# EAGLE design NixieDriver_mx (EAGLE 7.1.0)
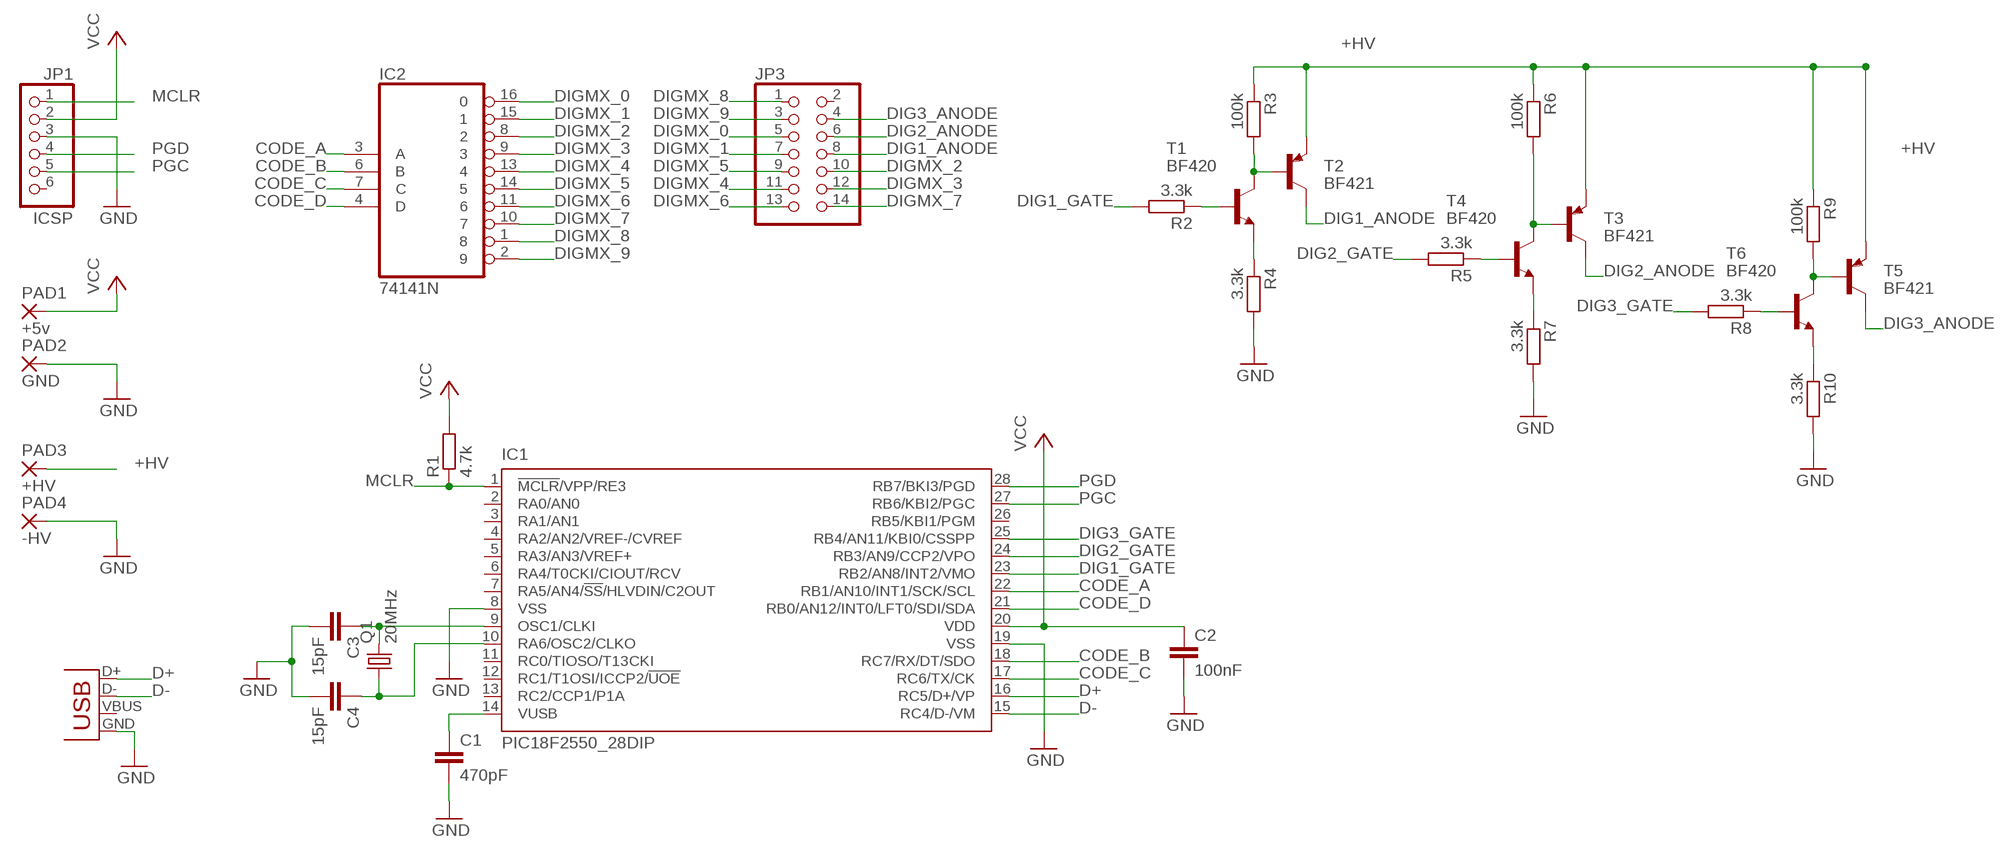
[diagram p0: schematic, sheet 1]

## Parts
C1  470pF  C-EU050-024X044  [C050-024X044]
C2  100nF  C-EU050-024X044  [C050-024X044]
C3  15pF  C-EU050-024X044  [C050-024X044]
C4  15pF  C-EU050-024X044  [C050-024X044]
IC1  PIC18F2550_28DIP  [DIL28-3]
IC2  74141N  [DIL16]
JP1  ICSP  PINHD-1X6  [1X06]
JP3  PINHD-2X7  [2X07]
PAD1  +5v  SMD5  [SMD2,54-5,08]
PAD2  GND  SMD5  [SMD2,54-5,08]
PAD3  +HV  SMD5  [SMD2,54-5,08]
PAD4  -HV  SMD5  [SMD2,54-5,08]
Q1  20MHz  CRYSTALHC49S  [HC49/S]
R1  4.7k  R-EU_0207/2V  [0207/2V]
R2  3.3k  R-EU_0207/2V  [0207/2V]
R3  100k  R-EU_0207/5V  [0207/5V]
R4  3.3k  R-EU_0207/7  [0207/7]
R5  3.3k  R-EU_0207/2V  [0207/2V]
R6  100k  R-EU_0207/5V  [0207/5V]
R7  3.3k  R-EU_0207/7  [0207/7]
R8  3.3k  R-EU_0207/2V  [0207/2V]
R9  100k  R-EU_0207/5V  [0207/5V]
R10  3.3k  R-EU_0207/7  [0207/7]
T1  BF420  BC368-NPN-TO92-ECB  [TO92-ECB]
T2  BF421  -PNP-TO92-ECB  [TO92-ECB]
T3  BF421  -PNP-TO92-ECB  [TO92-ECB]
T4  BF420  BC368-NPN-TO92-ECB  [TO92-ECB]
T5  BF421  -PNP-TO92-ECB  [TO92-ECB]
T6  BF420  BC368-NPN-TO92-ECB  [TO92-ECB]
X1  USB-B-H  [USB-B-H]

## Nets
+HV: PAD3.1(P) R3.1 R6.1 R9.1 T2.E T3.E T5.E
CODE_A: IC1.22(RB1/AN10/INT1/SCK/SCL) IC2.3(A)
CODE_B: IC1.18(RC7/RX/DT/SDO) IC2.6(B)
CODE_C: IC1.17(RC6/TX/CK) IC2.7(C)
CODE_D: IC1.21(RB0/AN12/INT0/LFT0/SDI/SDA) IC2.4(D)
D+: IC1.16(RC5/D+/VP) X1.D+
D-: IC1.15(RC4/D-/VM) X1.D-
DIG1_ANODE: JP3.8 T2.C
DIG1_GATE: IC1.23(RB2/AN8/INT2/VMO) R2.2
DIG2_ANODE: JP3.6 T3.C
DIG2_GATE: IC1.24(RB3/AN9/CCP2/VPO) R5.2
DIG3_ANODE: JP3.4 T5.C
DIG3_GATE: IC1.25(RB4/AN11/KBI0/CSSPP) R8.2
DIGMX_0: IC2.16 JP3.5
DIGMX_1: IC2.15 JP3.7
DIGMX_2: IC2.8 JP3.10
DIGMX_3: IC2.9 JP3.12
DIGMX_4: IC2.13 JP3.11
DIGMX_5: IC2.14 JP3.9
DIGMX_6: IC2.11 JP3.13
DIGMX_7: IC2.10 JP3.14
DIGMX_8: IC2.1 JP3.1
DIGMX_9: IC2.2 JP3.3
GND: C1.2 C2.2 C3.2 C4.2 IC1.8(VSS) IC1.19(VSS) JP1.3 PAD2.1(P) PAD4.1(P) R4.2 R7.2 R10.2 X1.GND
MCLR: IC1.1(!MCLR!/VPP/RE3) JP1.1 R1.1
N$1: C1.1 IC1.14(VUSB)
N$2: C3.1 IC1.9(OSC1/CLKI) Q1.2
N$3: C4.1 IC1.10(RA6/OSC2/CLKO) Q1.1
N$4: R3.2 T1.C T2.B
N$5: R2.1 T1.B
N$6: R4.1 T1.E
N$7: R6.2 T3.B T4.C
N$8: R7.1 T4.E
N$9: R5.1 T4.B
N$10: R9.2 T5.B T6.C
N$11: R10.1 T6.E
N$12: R8.1 T6.B
PGC: IC1.27(RB6/KBI2/PGC) JP1.5
PGD: IC1.28(RB7/BKI3/PGD) JP1.4
VCC: C2.1 IC1.20(VDD) JP1.2 PAD1.1(P) R1.2
Unconnected: IC1.2(RA0/AN0) IC1.3(RA1/AN1) IC1.4(RA2/AN2/VREF-/CVREF) IC1.5(RA3/AN3/VREF+) IC1.6(RA4/T0CKI/CIOUT/RCV) IC1.7(RA5/AN4/!SS!/HLVDIN/C2OUT) IC1.11(RC0/TIOSO/T13CKI) IC1.12(RC1/T1OSI/ICCP2/!UOE) IC1.13(RC2/CCP1/P1A) IC1.26(RB5/KBI1/PGM) JP1.6 JP3.2 X1.VBUS

## Power pins joined to a net without a drawn wire
GND: IC2.12(GND)
VCC: IC2.5(VCC)

## Library data of the parts
C1-C4 = rcl:C-EU: CAPACITOR, European symbol
IC1 = microchip:PIC18F2*_28: USB Microcontrollers with nanoWatt Technology High-Performance, Enhanced Flash, 28/40/44-Pin, Source: http://ww1.microchip.com/downloads/en/devicedoc/39632c.pdf; MF: MICROCHIP; MPN: PIC18F2550-I/SP; OC_FARNELL: 1523822; OC_NEWARK: 80K6054
IC2 = 74xx-eu:74*141: BCD to decimal DECODER/DRIVER
JP1 = pinhead:PINHD-1X6: PIN HEADER
JP3 = pinhead:PINHD-2X7: PIN HEADER
PAD1-PAD4 = wirepad:SMD5: SMD PAD
Q1 = crystal:CRYSTAL: CRYSTAL; OC_FARNELL: 1667008; OC_NEWARK: unknown
R1-R10 = rcl:R-EU_: RESISTOR, European symbol
T1 T4 T6 = transistor-neu-to92:*-NPN-: NPN Transistror
T2 T3 T5 = transistor-neu-to92:*-PNP-: PNP Transistror
X1 = con-usb:USB: USB Connectors

## Board
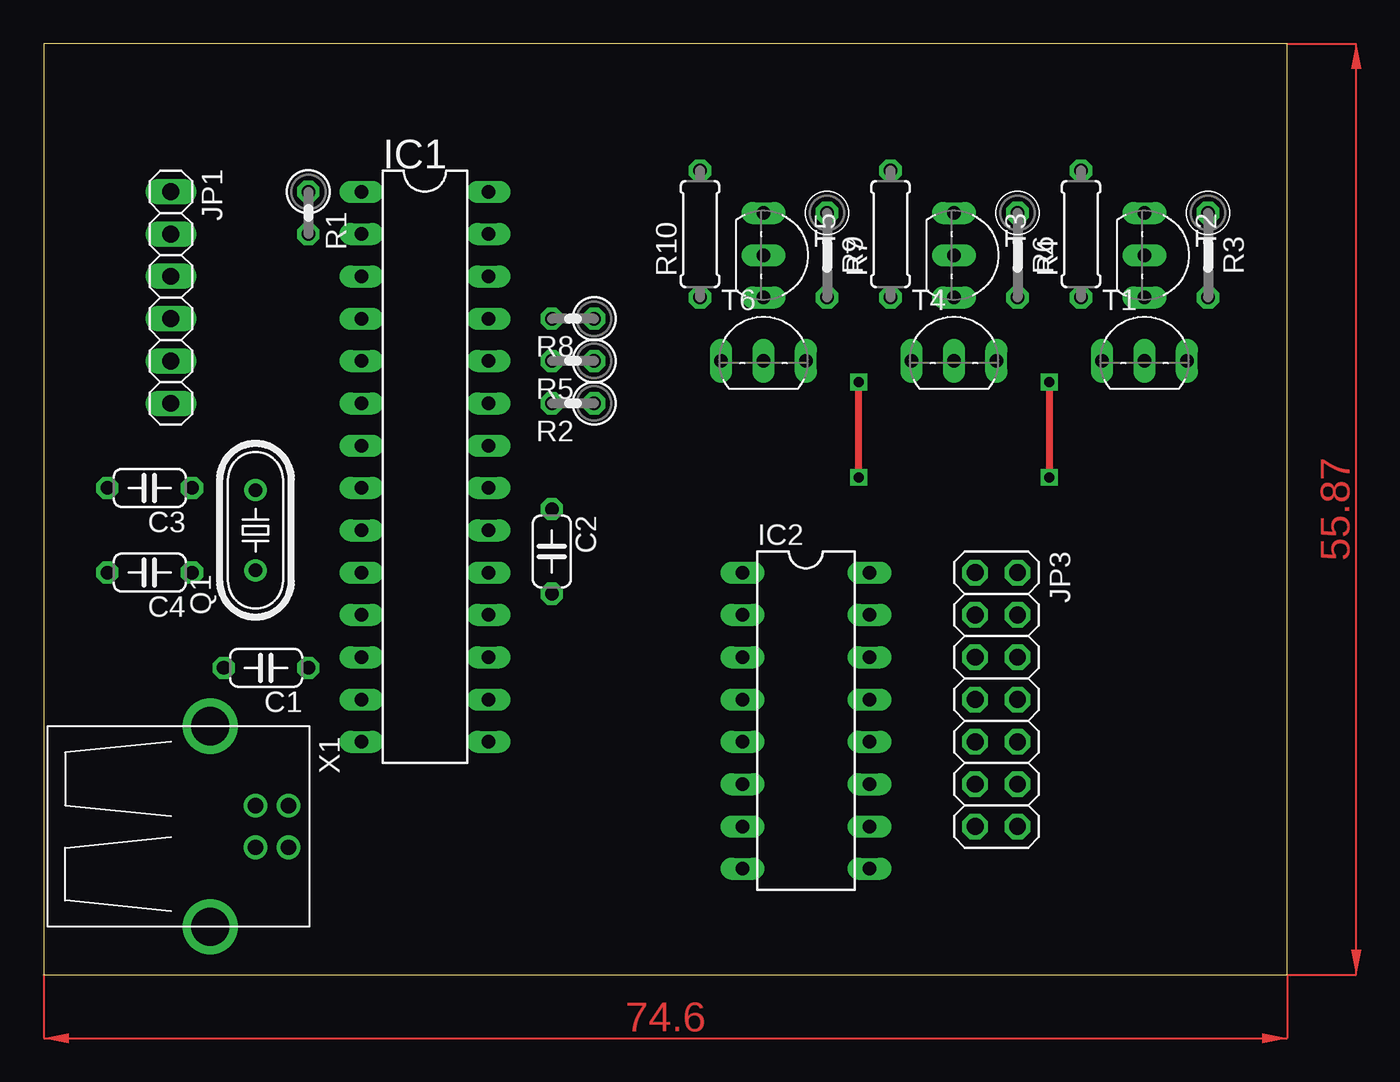
[diagram p1: board, top side]
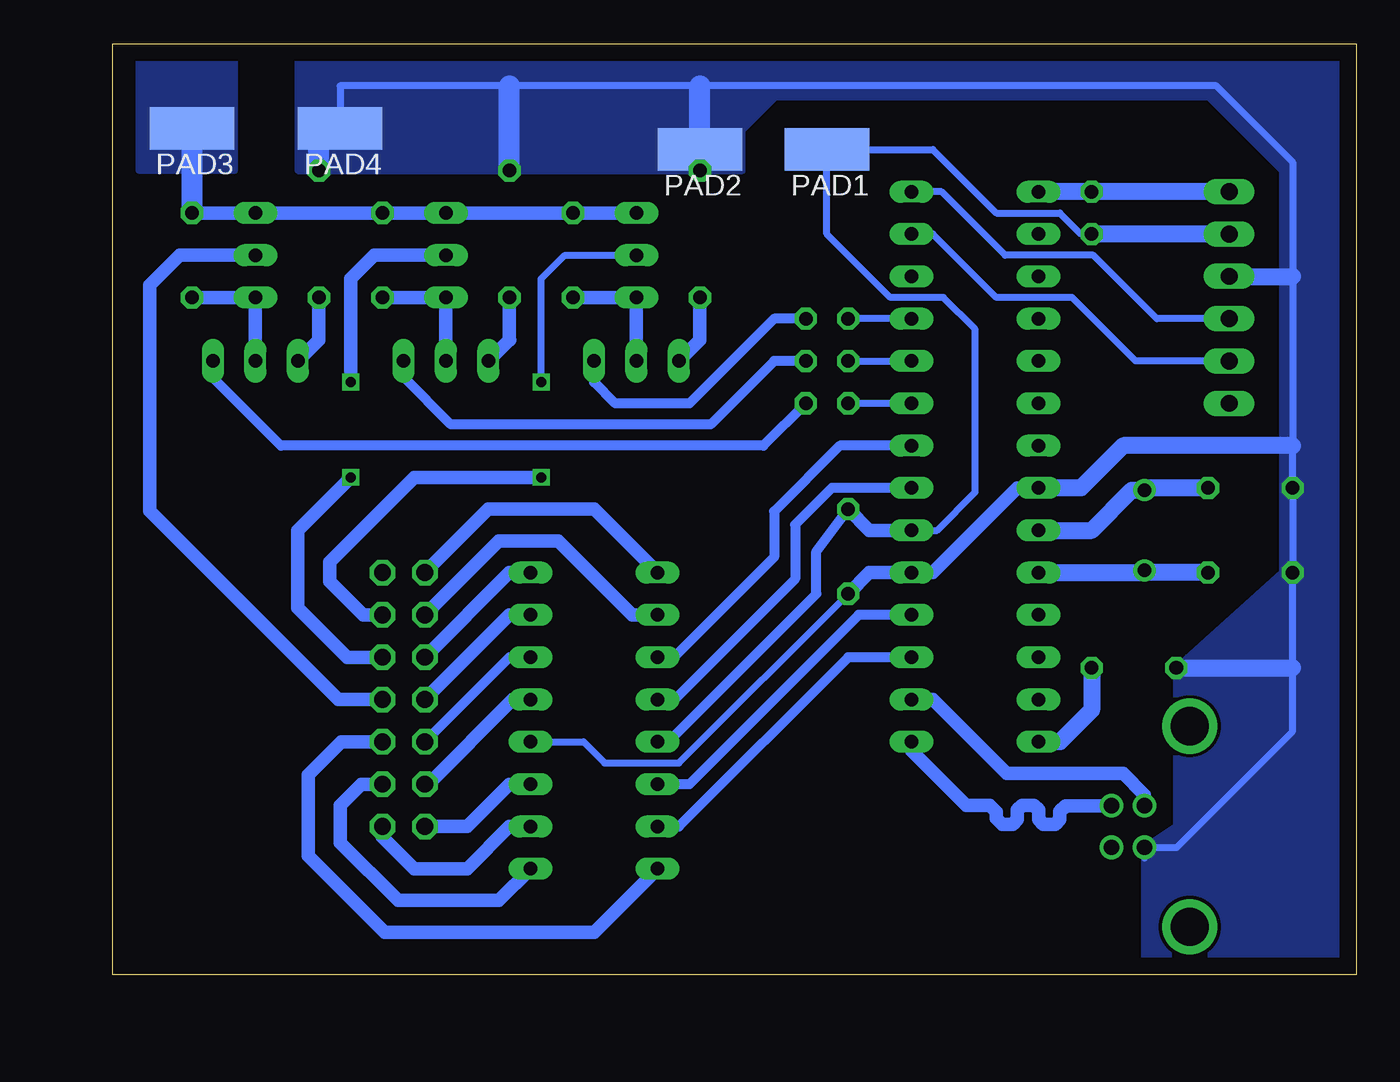
[diagram p2: board, bottom side, seen from below]

Size 74.6 x 55.87 mm. Coordinates in mm from the lower left corner, seen from the top.
Outline: 0,0 74.6,0 74.6,55.87 0,55.87 0,0
Copper layers (1*16): Top 0.035mm / dielectric 1.5mm / Bottom 0.035mm
Design rules "default": minimum track width 10mil, minimum drill 24mil, track to track 8mil, track to pad 8mil, pad to pad 8mil, via to via 8mil, smd to smd 8mil, copper to edge 40mil, drill to drill 8mil, minimum pad ring 10mil, minimum via ring 8mil, stop-mask expansion 4mil, vias tented up to drill 0mil, thermal gap 10mil

### Footprints (pad centres in the part's own frame; a part is rotated, then mirrored left to right if it is on the bottom)
C050-024X044 = drill 0.813 octagon: 1 -2.54,0; 2 2.54,0
DIL28-3 = drill 0.813 long: 1 -16.51,-3.81; 2 -13.97,-3.81; 3 -11.43,-3.81; 4 -8.89,-3.81; 5 -6.35,-3.81; 6 -3.81,-3.81; 7 -1.27,-3.81; 8 1.27,-3.81; 9 3.81,-3.81; 10 6.35,-3.81; 11 8.89,-3.81; 12 11.43,-3.81; 13 13.97,-3.81; 14 16.51,-3.81; 15 16.51,3.81; 16 13.97,3.81; 17 11.43,3.81; 18 8.89,3.81; 19 6.35,3.81; 20 3.81,3.81; 21 1.27,3.81; 22 -1.27,3.81; 23 -3.81,3.81; 24 -6.35,3.81; 25 -8.89,3.81; 26 -11.43,3.81; 27 -13.97,3.81; 28 -16.51,3.81
DIL16 = drill 0.813 long: 1 -8.89,-3.81; 2 -6.35,-3.81; 3 -3.81,-3.81; 4 -1.27,-3.81; 5 1.27,-3.81; 6 3.81,-3.81; 7 6.35,-3.81; 8 8.89,-3.81; 9 8.89,3.81; 10 6.35,3.81; 11 3.81,3.81; 12 1.27,3.81; 13 -1.27,3.81; 14 -3.81,3.81; 15 -6.35,3.81; 16 -8.89,3.81
1X06 = drill 1.016 long: 1 -6.35,0; 2 -3.81,0; 3 -1.27,0; 4 1.27,0; 5 3.81,0; 6 6.35,0
2X07 = drill 1.016 octagon: 1 -7.62,-1.27; 2 -7.62,1.27; 3 -5.08,-1.27; 4 -5.08,1.27; 5 -2.54,-1.27; 6 -2.54,1.27; 7 0,-1.27; 8 0,1.27; 9 2.54,-1.27; 10 2.54,1.27; 11 5.08,-1.27; 12 5.08,1.27; 13 7.62,-1.27; 14 7.62,1.27
SMD2,54-5,08 = smd 2.54 x 5.08: 1 0,0
HC49/S = drill 0.813: 1 -2.413,0; 2 2.413,0
0207/2V = drill 0.813 octagon: 1 -1.27,0; 2 1.27,0
0207/5V = drill 0.813 octagon: 1 -2.54,0; 2 2.54,0
0207/7 = drill 0.813 octagon: 1 -3.81,0; 2 3.81,0
TO92-ECB = drill 0.813 long: B 2.54,0; C 0,0; E -2.54,0
USB-B-H = drill 0.914: D+ 0,1.25; D- 1.981,1.25; GND 0,-1.25; VBUS 1.981,-1.25 | drill 2.286: P$1 -2.718,-6.02; P$2 -2.718,6.02

### Placement (x,y rotation side)
C1  13.34,18.41 180 top
C2  30.48,25.4 270 top
C3  6.35,29.21 180 top
C4  6.35,24.13 180 top
IC1  22.86,30.48 270 top
IC2  45.72,15.24 270 top
JP1  7.62,40.64 270 top
JP3  57.15,16.51 270 top
PAD1  31.75,49.53 90 bottom
PAD2  39.37,49.53 90 bottom
PAD3  69.85,50.8 90 bottom
PAD4  60.96,50.8 90 bottom
Q1  12.7,26.67 90 top
R1  15.88,45.72 270 top
R2  31.75,34.29 180 top
R3  69.85,43.18 270 top
R4  62.23,44.45 90 top
R5  31.75,36.83 180 top
R6  58.42,43.18 270 top
R7  50.8,44.45 90 top
R8  31.75,39.37 180 top
R9  46.99,43.18 270 top
R10  39.37,44.45 90 top
T1  66.04,36.83 0 top
T2  66.04,43.18 270 top
T3  54.61,43.18 270 top
T4  54.61,36.83 0 top
T5  43.18,43.18 270 top
T6  43.18,36.83 0 top
X1  12.7,8.89 0 top

### Tracks (layer width: path | path; a pad name or v marks a point on that pad's centre or on a via)
+HV
  Bottom 0.813: R3.1 T2.E R6.1 T3.E R9.1 T5.E
  Bottom 1.27: PAD3.1 R3.1
  pour Bottom (no thermals): 67.31,48.26 73.03,48.26 73.03,55.88 67.31,55.88
CODE_A
  Bottom 0.61: IC1.22 30.98,31.75 34.92,27.81 34.92,25.07 40.94,19.05 IC2.3
CODE_B
  Bottom 0.61: IC1.18 29.84,21.59 40.01,11.43 IC2.6
CODE_C
  Bottom 0.61: IC1.17 30.48,19.05 40.64,8.89 IC2.7
CODE_D
  Bottom 0.61: IC1.21 31.45,29.21 33.66,27 33.66,23.75 40.9,16.51 IC2.4
D+
  Bottom 0.813: X1.D+ 12.7,10.79 13.97,12.06 20.95,12.06 25.4,16.51 IC1.16
D-
  Bottom 0.813: X1.D- 17.43,10.14 17.78,9.79 17.78,9.3 18.06,9.02 18.77,9.02 19.05,9.3 19.05,9.88 19.33,10.16 20.04,10.16 20.32,9.88 20.32,9.3 20.6,9.02 21.23,9.02 21.59,9.38 21.59,9.76 21.99,10.16 23.39,10.16 26.67,13.44 IC1.15
DIG1_ANODE
  Bottom 0.813: JP3.8 61.08,16.51 72.39,27.82 72.39,41.38 70.59,43.18 T2.C
DIG1_GATE
  Bottom 0.406: IC1.23 R2.2
DIG2_ANODE  (via drill 0.6)
  Top 0.406: v60.33,35.56 v60.33,29.84
  Bottom 0.813: T3.C 58.91,43.18 60.33,41.76 v60.33,35.56 | v60.33,29.84 63.5,26.67 63.5,22.01 60.54,19.05 JP3.6
DIG2_GATE
  Bottom 0.406: R5.2 IC1.24
DIG3_ANODE  (via drill 0.6)
  Top 0.406: v48.9,29.84 v48.9,35.56
  Bottom 0.406: v48.9,35.56 48.9,41.76 47.48,43.18 T5.C
  Bottom 0.813: JP3.4 59.59,21.59 61.59,23.6 61.59,24.77 56.52,29.84 v48.9,29.84
DIG3_GATE
  Bottom 0.406: IC1.25 R8.2
DIGMX_0
  Bottom 0.813: JP3.5 50.8,24.13 IC2.16
DIGMX_1
  Bottom 0.813: JP3.7 50.8,21.59 IC2.15
DIGMX_2
  Bottom 0.813: JP3.10 60.88,13.97 62.87,11.99 62.87,7.12 58.29,2.54 45.72,2.54 IC2.8
DIGMX_3
  Bottom 0.813: JP3.12 59.69,11.43 60.96,10.16 60.96,7.92 57.48,4.45 51.44,4.45 IC2.9
DIGMX_4
  Bottom 0.813: JP3.11 55.67,11.43 50.59,16.51 IC2.13
DIGMX_5
  Bottom 0.61: JP3.9 50.8,19.05 IC2.14
DIGMX_6
  Bottom 0.813: JP3.13 53.34,8.89 50.8,11.43 IC2.11
DIGMX_7
  Bottom 0.813: JP3.14 58.42,8.26 56.52,6.35 53.34,6.35 50.8,8.89 IC2.10
DIGMX_8
  Bottom 0.813: IC2.1 45.72,27.94 52.07,27.94 JP3.1
DIGMX_9
  Bottom 0.813: IC2.2 43.43,21.59 47.88,26.04 51.44,26.04 JP3.3
GND
  Bottom 0.406: IC2.12 46.35,13.97 45.09,12.7 40.64,12.7 C2.2 | 12.7,6.99 X1.GND 12.7,7.62 10.79,7.62 3.81,14.61 3.81,18.41 C4.2 C3.2 3.81,31.75 3.81,41.91 3.81,48.76 8.39,53.34 39.37,53.34 50.8,53.34 60.96,53.34 PAD4.1 62.23,50.8
  Bottom 0.813: C2.2 29.21,24.13 IC1.19 25.4,24.13 20.32,29.21 IC1.8
  Bottom 1.016: 3.81,31.75 13.97,31.75 16.51,29.21 IC1.8 | JP1.3 3.81,41.91 | C1.2 3.81,18.41
  Bottom 1.27: R10.2 39.37,53.34 | R7.2 50.8,53.34 | R4.2 62.23,50.8
  pour Bottom (no thermals): 0,0 0,55.88 63.5,55.88 63.5,48.26 36.83,48.26 36.83,50.7 34.82,52.7 8.89,52.7 4.45,48.26 4.45,24.13 10.79,18.41 10.79,8.89 12.7,7.62 12.7,0
MCLR
  Bottom 1.016: IC1.1 R1.1 JP1.1
N$1
  Bottom 1.016: C1.1 15.88,15.88 17.78,13.97 IC1.14
N$2
  Bottom 0.406: 12.7,29.21 Q1.2
  Bottom 1.016: C3.1 12.7,29.21 | IC1.9 15.88,26.67 13.46,29.08 Q1.2
N$3
  Bottom 0.406: 12.7,24.13 Q1.1 12.57,24.13
  Bottom 1.016: IC1.10 12.7,24.13 | C4.1 12.57,24.13
N$4
  Bottom 0.813: T1.C T2.B R3.2
N$5
  Bottom 0.61: R2.1 35.56,31.75 64.51,31.75 68.58,35.82 T1.B
N$6
  Bottom 0.813: R4.1 62.23,38.1 T1.E
N$7
  Bottom 0.813: T4.C T3.B R6.2
N$8
  Bottom 0.813: R7.1 50.8,38.1 T4.E
N$9
  Bottom 0.61: R5.1 34.92,36.83 38.73,33.02 54.31,33.02 57.15,35.86 T4.B
N$10
  Bottom 0.813: R9.2 T5.B T6.C
N$11
  Bottom 0.813: R10.1 39.37,38.1 T6.E
N$12
  Bottom 0.61: R8.1 34.92,39.37 40.01,34.29 44.45,34.29 45.72,35.56 T6.B
PGC
  Bottom 0.406: JP1.5 13.23,36.83 17.04,40.64 21.59,40.64 25.4,44.45 IC1.27
PGD
  Bottom 0.406: JP1.4 11.96,39.37 15.77,43.18 21.06,43.18 24.87,46.99 IC1.28
VCC
  Bottom 0.406: IC1.20 25.15,26.67 22.86,28.96 22.86,38.73 24.77,40.64 27.94,40.64 31.75,44.45 PAD1.1 25.4,49.53 21.59,45.72 17.78,45.72 16.51,44.45 R1.2 | JP1.2 6.35,44.45
  Bottom 0.61: IC2.5 41.27,13.97 32.38,22.86 32.38,25.4 C2.1
  Bottom 0.813: IC1.20 29.21,26.67 C2.1
  Bottom 1.016: JP1.2 R1.2
(copper drawn outside any net)
  shapes: Top area x2